# Altium schematic sheet YA-N-Power_Supply.SchDoc: Yet Another IoT Node - Power
size A4; Revision: 2.0; SheetNumber: 2; SheetTotal: 5
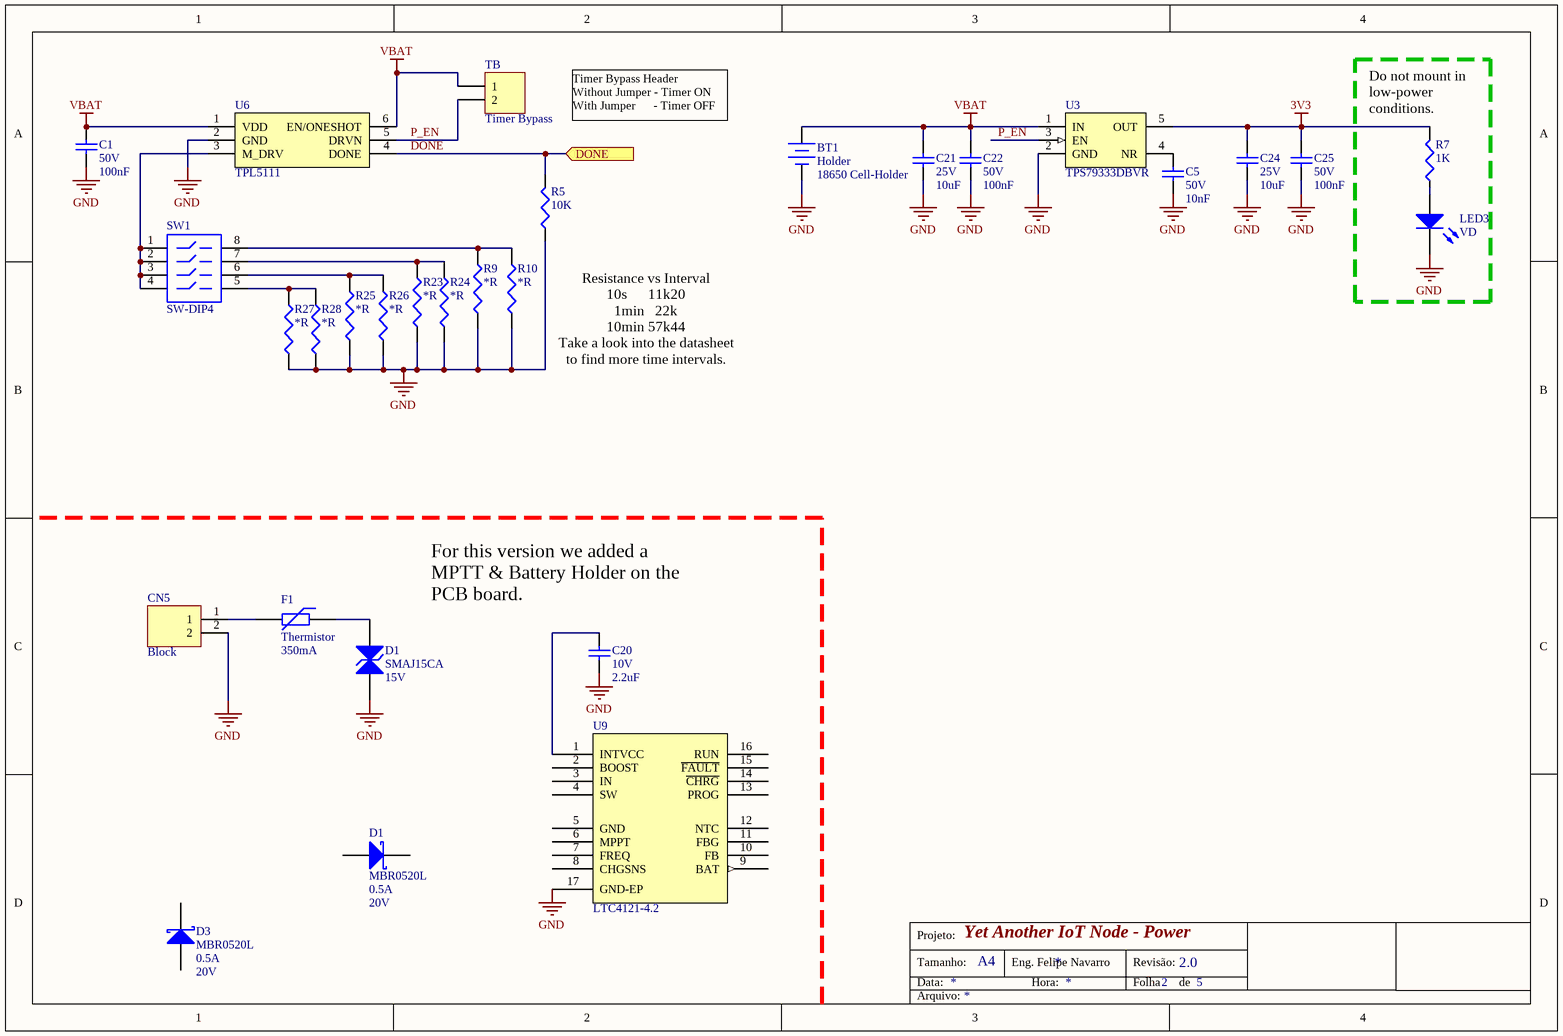
[diagram p0: YA-N-Power_Supply.SchDoc]

## Parts
(Parts that share a designator on the sheet are numbered #1, #2 ... from top to bottom, then left to right.)
BT1  Holder  value 18650 Cell-Holder  [KEYSTONE 54]
C1  value 100nF  Tensão: 50V  [CC0603]  (hidden comment: Capacitor Cerâmico)
C5  value 10nF  Tensão: 50V  [CC0603]  (hidden comment: Capacitor Cerâmico)
C20  value 2.2uF  Tensão: 10V  [CC0805]  (hidden comment: Capacitor Cerâmico)
C21  value 10uF  Tensão: 25V  [CC0805]  (hidden comment: Capacitor Cerâmico)
C22  value 100nF  Tensão: 50V  [CC0603]  (hidden comment: Capacitor Cerâmico)
C24  value 10uF  Tensão: 25V  [CC0805]  (hidden comment: Capacitor Cerâmico)
C25  value 100nF  Tensão: 50V  [CC0603]  (hidden comment: Capacitor Cerâmico)
CN5  Block  [CONN SHRD.BL2 RCPT/H]
D1#1  SMAJ15CA  Tensão: 15V  [SMA BIDIR]
D1#2  MBR0520L  Corrente: 0.5A  Tensão: 20V  [SOD-123F]
D3  MBR0520L  Corrente: 0.5A  Tensão: 20V  [SOD-123F]
F1  Thermistor  Current Hold: 350mA  [CC1206]
LED3  value VD  [LED 0603]  (hidden comment: LED)
R5  value 10K  [CC0603]  (hidden comment: Resistor)
R7  value 1K  [CC0603]  (hidden comment: Resistor)
R9  value *R  [CC0603]  (hidden comment: Resistor)
R10  value *R  [CC0603]  (hidden comment: Resistor)
R23  value *R  [CC0603]  (hidden comment: Resistor)
R24  value *R  [CC0603]  (hidden comment: Resistor)
R25  value *R  [CC0603]  (hidden comment: Resistor)
R26  value *R  [CC0603]  (hidden comment: Resistor)
R27  value *R  [CC0603]  (hidden comment: Resistor)
R28  value *R  [CC0603]  (hidden comment: Resistor)
SW1  SW-DIP4  [SWITCH-DIP8]
TB  Timer Bypass  [CONN HDR1X2]
U3  TPS79333DBVR  [SOT-23-5N]
U6  TPL5111  [TSOT-23-6N]
U9  LTC4121-4.2  [QFN3X3-17N]

## Ports
DONE (in)

## Nets
3V3: C24.2 C25.2 R7.2 U3.5(OUT)
GND: BT1.2(-) C1.1 C5.1 C20.1 C21.1 C22.1 C24.1 C25.1 CN5.2 D1#1.1(A) LED3.2(K) R5.1 R9.1 R10.1 R23.1 R24.1 R25.1 R26.1 R27.1 R28.1 U3.2(GND) U6.2(GND) U9.17(GND-EP)
VBAT: BT1.1(+) C1.2 C21.2 C22.2 TB.1 U3.1(IN) U6.1(VDD) U6.6(EN/ONESHOT)
DONE: R5.2 U6.4(DONE) ; port DONE
P_EN: TB.2 U3.3(EN) U6.5(DRVN)
NetC5_2: C5.2 U3.4(NR)
NetC20_2: C20.2 U9.1(INTVCC)
NetCN5_1: CN5.1 F1.2
NetD1#1_2: D1#1.2(K) F1.1
NetLED3_1: LED3.1(A) R7.1
NetR9_2: R9.2 R10.2 SW1.8
NetR23_2: R23.2 R24.2 SW1.7
NetR25_2: R25.2 R26.2 SW1.6
NetR27_2: R27.2 R28.2 SW1.5
NetSW1_1: SW1.1 SW1.2 SW1.3 SW1.4 U6.3(M_DRV)

Not connected (* = marked no-connect by the designer): D1#2 1(A) 2(K); D3 1(A) 2(K); U9 2(BOOST) 3(IN) 4(SW) 5(GND) 6(MPPT) 7(FREQ) 8(CHGSNS) 9(BAT) 10(FB) 11(FBG) 12(NTC) 13(PROG) 14(~{CHRG}) 15(~{FAULT}) 16(RUN)

## Notes on the sheet
- Timer Bypass Header
  Without Jumper - Timer ON
  With Jumper      - Timer OFF
- (near R7) Do not mount in low-power conditions.
- Resistance vs Interval
  10s      11k20
  1min   22k
  10min 57k44
  Take a look into the datasheet to find more time intervals.
- (near C20) For this version we added a MPTT & Battery Holder on the PCB board.
- Projeto:
- Tamanho:
- Data:
- A4
- Eng. Felipe Navarro
- Hora:
- Revisão:
- Folha
- de
- Arquivo:

## Library data of the parts
BT1 = BattHolder 18650: Corrente: *A; Chinês: ----; ChinesePrice: 0,00000; Tensão: *V; Potência: *; Supplier 1: Digi-Key; Supplier Part Number 1: 36-54-ND; Obs:: *; Tolerância: *; ComponentLink1Description: Datasheet; ComponentLink1URL: D:\Tecnoclade\Datasheet\
C1 C22 C25 = Cap 100nF 50V 0603 X7R: Capacitor (Semiconductor SIM Model); Chinês: Local; ChinesePrice: 0,00250; Corrente: *A; Potência: *W; Obs:: X7R; Tolerância: ±10%; Supplier 1: Digi-Key; Supplier Part Number 1: 1276-1000-1-ND; ComponentLink1Description: Datasheet; ComponentLink1URL: D:\Tecnoclade\Datasheet\!DataMissing.pdf
C5 = Cap 10nF 50V 0603 X7R 5%: Capacitor (Semiconductor SIM Model); Chinês: Local; ChinesePrice: 0,00320; Corrente: *A; Potência: *W; Obs:: X7R; Tolerância: ±5%; Supplier 1: Digi-Key; Supplier Part Number 1: 399-1092-1-ND; ComponentLink1Description: Datasheet; ComponentLink1URL: D:\Tecnoclade\Datasheet\!DataMissing.pdf
C20 = Cap 2.2uF 10V 0805 X7R: Capacitor (Semiconductor SIM Model); Chinês: -----; ChinesePrice: 0,00000; Corrente: *A; Potência: *W; Obs:: X7R; Tolerância: ±10%; Supplier 1: Digi-Key; Supplier Part Number 1: 587-1286-1-ND; ComponentLink1Description: Datasheet; ComponentLink1URL: D:\Tecnoclade\Datasheet\!DataMissing.pdf
C21 C24 = Cap 10uF 25V 0805 X5R: Capacitor (Semiconductor SIM Model); Chinês: Local; ChinesePrice: 0,02620; Corrente: *A; Potência: *W; Obs:: X5R; Tolerância: ±10%; Supplier 1: Digi-Key; Supplier Part Number 1: 587-2985-1-ND; ComponentLink1Description: Datasheet; ComponentLink1URL: D:\Tecnoclade\Datasheet\!DataMissing.pdf
CN5 = SHRD Block 2P RCPT-H P5.08mm: Conector Shrouded Block; ChinesePrice: 0,03930; Chinês: Local; Corrente: 15A; Tensão: 300V; Value: Receptáculo - 2 Polos; Potência: *; Supplier 1: Digi-Key; Supplier Part Number 1: A98065-ND; Obs:: *; Tolerância: *; ComponentLink1Description: Datasheet; ComponentLink1URL: D:\Tecnoclade\Datasheet\!DataMissing.pdf
D1#1 = TVS 15V 5% SMA BI 400W: Transient Voltage Supressor diode; ChinesePrice: 0,05900; Chinês: Local; Potência: 400W; Value: TVS; Obs:: Bidirecional; Tolerância: ±5%; Corrente: *; Supplier 1: Digi-Key; Supplier Part Number 1: SMAJ15CABCT-ND; ComponentLink1Description: Datasheet; ComponentLink1URL: D:\Tecnoclade\Datasheet\!DataMissing.pdf
D1#2 D3 = DS 20V 0.5A 385mV SOD-123: Schottky Diode; ChinesePrice: 0,00000; Chinês: ----; Value: Vf=385mV@500mA; Obs:: Fast Recovery =< 500ns, > 200mA (Io); Potência: *; Supplier 1: Digi-Key; Supplier Part Number 1: MBR0520L-TPMSCT-ND; Tolerância: *; ComponentLink1Description: Datasheet; ComponentLink1URL: D:\Tecnoclade\Datasheet\!DataMissing.pdf
F1 = Res Varistor: Varistor (Voltage-Sensitive Resistor); Tensão: 30v; ChinesePrice: 0,09500; Chinês: Local; Supplier 1: Digi-Key; Supplier Part Number 1: 507-1800-1-ND; ComponentLink1Description: Datasheet; ComponentLink1URL: D:\Tecnoclade\Datasheet\!DataMissing.pdf
LED3 = LED 0603 VD 2V 75mW: ChinesePrice: 0,02810; Chinês: Local; Corrente: 20mA; Potência: 75mW; Tensão: 2V; Obs:: 35mcd@130º; Supplier 1: Digi-Key; Supplier Part Number 1: 160-1478-1-ND; Tolerância: *; ComponentLink1Description: Datasheet; ComponentLink1URL: D:\Tecnoclade\Datasheet\!DataMissing.pdf
R5 = Res 10K 1% 0603 1/10W: ChinesePrice: 0,00089; Chinês: Local; Corrente: *A; Potência: 1/10W; Tensão: *V; Tolerância: ±1%; Supplier 1: Digi-Key; Supplier Part Number 1: P10.0KHCT-ND; Obs: *; ComponentLink1Description: Datasheet; ComponentLink1URL: D:\Tecnoclade\Datasheet\!DataMissing.pdf
R7 = Res 1K 1% 0603 1/10W: ChinesePrice: 0,00089; Chinês: Local; Corrente: *A; Potência: 1/10W; Tensão: *V; Tolerância: ±1%; Supplier 1: Digi-Key; Supplier Part Number 1: RMCF0603FT1K00CT-ND; Obs: *; ComponentLink1Description: Datasheet; ComponentLink1URL: D:\Tecnoclade\Datasheet\!DataMissing.pdf
R9 R10 R23-R28 = Res - $Val $% $Footprint $Pot: ChinesePrice: 0,00000; Chinês: ----; Corrente: *A; Potência: 1/10W; Tensão: *V; Tolerância: ±*%; Supplier 1: Digi-Key; Supplier Part Number 1: --Del; Obs:: *; ComponentLink1Description: Datasheet; ComponentLink1URL: D:\Tecnoclade\Datasheet\!DataMissing.pdf
SW1 = SW-DIP4: 4009 Series DIP Switch, Raised actuator; Value: SPST; ChinesePrice: 0,00000; Chinês: ----; Corrente: *; Potência: *; Supplier 1: Digi-Key; Supplier Part Number 1: --Del; Tensão: *; Obs:: *; Tolerância: *; ComponentLink1Description: Datasheet; ComponentLink1URL: D:\Tecnoclade\Datasheet\
TB = Header 2: Header, 2-Pin; ChinesePrice: 0,10000; Chinês: Proved - Local; Value: Barra de 40 pinos - ATENÇÃO; Corrente: *; Potência: *; Supplier 1: Digi-Key; Supplier Part Number 1: A26509-40-ND; Tensão: *; Obs:: *; Tolerância: *; ComponentLink1Description: Datasheet; ComponentLink1URL: D:\Tecnoclade\Datasheet\!DataMissing.pdf
U3 = TPS79333: ULTRALOW-NOISE, HIGH PSRR, FAST RF 200mA LOW-DROPOUT LINEAR  REGULATORS I; Tensão: 3V3; ChinesePrice: 0,00000; Chinês: ----; Corrente: 200mA; Potência: *; Supplier 1: Digi-Key; Supplier Part Number 1: 296-12961-1-ND; Value: *; Obs:: *; Tolerância: *; ComponentLink1Description: Datasheet; ComponentLink1URL: D:\Tecnoclade\Datasheet\
U6 = TPL5111: Nano-Power System Timer for Power Gating; Chinês: Local; Corrente: *; Potência: *; Supplier 1: Digi-Key; Supplier Part Number 1: 296-42621-1-ND; Tensão: *; Obs:: *; Tolerância: *; ComponentLink1Description: Datasheet; ComponentLink1URL: D:\Tecnoclade\Datasheet\!DataMissing.pdf
U9 = LTC4121-4.2: 40V 400mA Synchronous  Step-Down Battery Charger; ChinesePrice: 0,00000; Chinês: ----; Supplier 1: Digi-Key; Supplier Part Number 1: LTC4121IUD#PBF-ND; Corrente: *; Potência: *; Tensão: *; Value: *; Obs:: *; Tolerância: *; ComponentLink1Description: Datasheet